# Altium schematic sheet breeze_sensor.SchDoc: Breeze Quadcopter
size A4; Author: myyerrol; Organization: Team MicroDynamics; Address1: NWPU; Address2: Xi'an; Address3: Shannxi; Address4: China; Revision: V0.1; SheetNumber: 4; SheetTotal: 5
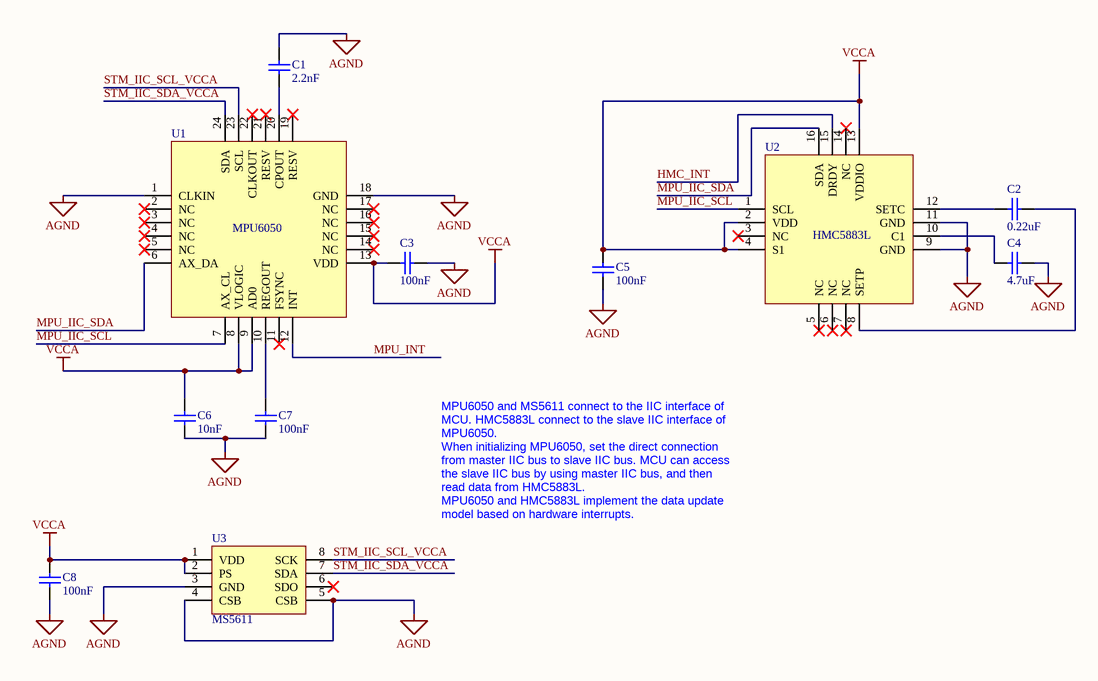
[diagram p0: breeze_sensor.SchDoc]

## Parts
C1  value 2.2nF  [SMD-0603]  (hidden comment: CAP-0603)
C2  value 0.22uF  [SMD-0603]  (hidden comment: CAP-0603)
C3  value 100nF  [SMD-0603]  (hidden comment: CAP-0603)
C4  value 4.7uF  [SMD-0603]  (hidden comment: CAP-0603)
C5  value 100nF  [SMD-0603]  (hidden comment: CAP-0603)
C6  value 10nF  [SMD-0603]  (hidden comment: CAP-0603)
C7  value 100nF  [SMD-0603]  (hidden comment: CAP-0603)
C8  value 100nF  [SMD-0603]  (hidden comment: CAP-0603)
U1  MPU6050  [QFN-24]
U2  HMC5883L  [LPCC-16]
U3  MS5611  [MS5611]

## Nets
AGND: C1.2 C3.2 C4.2 C5.2 C6.2 C7.2 C8.2 U1.1(CLKIN) U1.18(GND) U2.9(GND) U2.11(GND) U3.3(GND) U3.4(CSB) U3.5(CSB)
VCCA: C3.1 C5.1 C6.1 C8.1 U1.8(VLOGIC) U1.9(AD0) U1.13(VDD) U2.2(VDD) U2.4(S1) U2.13(VDDIO) U3.1(VDD) U3.2(PS)
HMC_INT: U2.15(DRDY)
MPU_IIC_SCL: U1.7(AX_CL) U2.1(SCL)
MPU_IIC_SDA: U1.6(AX_DA) U2.16(SDA)
MPU_INT: U1.12(INT)
STM_IIC_SCL_VCCA: U1.23(SCL) U3.8(SCK)
STM_IIC_SDA_VCCA: U1.24(SDA) U3.7(SDA)
NetC1_1: C1.1 U1.20(CPOUT)
NetC2_1: C2.1 U2.12(SETC)
NetC2_2: C2.2 U2.8(SETP)
NetC4_1: C4.1 U2.10(C1)
NetC7_1: C7.1 U1.10(REGOUT)

Not connected (* = marked no-connect by the designer): U1 2(NC)* 3(NC)* 4(NC)* 5(NC)* 11(FSYNC)* 14(NC)* 15(NC)* 16(NC)* 17(NC)* 19(RESV)* 21(RESV)* 22(CLKOUT)*; U2 3(NC)* 5(NC)* 6(NC)* 7(NC)* 14(NC)*; U3 6(SDO)*

## Notes on the sheet
- MPU6050 and MS5611 connect to the IIC interface of MCU. HMC5883L connect to the slave IIC interface of MPU6050.
  When initializing MPU6050, set the direct connection from master IIC bus to slave IIC bus. MCU can access the slave IIC bus by using master IIC bus, and then read data from HMC5883L.
  MPU6050 and HMC5883L implement the data update model based on hardware interrupts.
- Title
- Size:
- Date:
- A4
- Author:
- Time:
- Revision:
- Sheet
- of
- File:

## Library data of the parts
C1-C8 = CAP-0603: Capacitor
U1 = MPU6050: 6-axis Motion Tracking IC
U2 = HMC5883L: 3-Axis Digital Compass IC
U3 = MS5611: High Resolution Altimeter IC